# Altium project Finger_PCB.PrjPcb
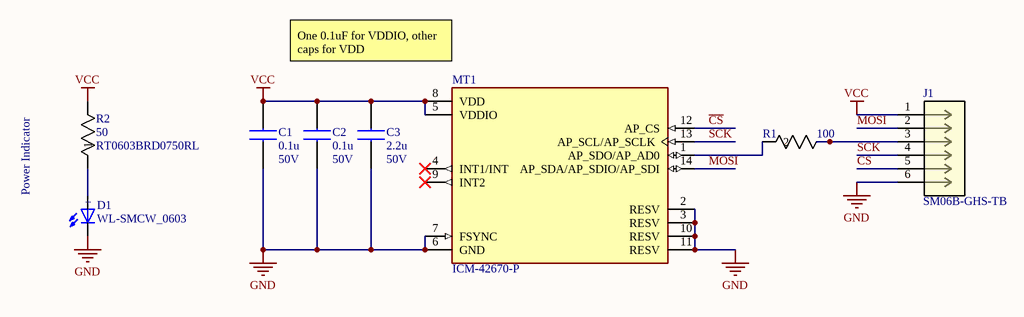
[diagram p0: Finger_IMU_PCB.SchDoc]
SCH_REV: A; PCB_REV: A; PCB_PART_NUMBER: <PCB PN>; PCB_ENGINEER_APP_DATE: --/--/----; PCB_ENGINEER: - -----; PCB_DWG_NO: <PCB DWG NO>; PCB_DESIGNER_APP_DATE: --/--/----; PCB_DESIGNER: - -----; PCB_CHECKER_APP_DATE: --/--/----; PCB_CHECKER: - -----; PCB_ASSEMBLY_NO: <PCB ASSY NO>; PCB_ANG_TOL: +/-1/2; PCB_3_DEC_TOL: +/-.010; PCB_2_DEC_TOL: +/-.01; DOC_NO_SCH_DWG: <SCH DWG NO>; DOC_NO_FAB_DWG: <FAB DWG NO>; DOC_NO_BOM: <BOM DOC NO>; DOC_NO_ASSY_DWG: <ASSY DWG NO>; CONTRACT_NUMBER: <CONTRACT NO>; CAGE_CODE: ?????
1 sheet, 8 parts. Net scope: strictly hierarchical (ports join the sheet entries above them; power ports are local).
Board file: Finger_IMU_PCB.PcbDoc

## Sheet Finger_IMU_PCB.SchDoc
size A; SheetNumber: 1; SheetTotal: 1

### Parts
C1  value 0.1u  Rated Voltage: 50V  [CAPC2012X145N]  (hidden comment: KAM21BR71H104JM)
C2  value 0.1u  Rated Voltage: 50V  [CAPC2012X145N]  (hidden comment: KAM21BR71H104JM)
C3  value 2.2u  Rated Voltage: 50V  [CAPC2012X145N]  (hidden comment: C2012X7R1H225K125AE)
D1  WL-SMCW_0603  [WL-SMCW_0603]
J1  SM06B-GHS-TB  [CONN_SM06B-GHS-TB_JST]
MT1  ICM-42670-P  [XDCR_ICM-42670-P]
R1  value 100  [RC0805N_YAG]  (hidden comment: RC0805JR-07100RL)
R2  RT0603BRD0750RL  value 50  [RES_RT0603_YAG]

### Nets
GND: C1.1 C2.1 C3.1 D1.1(NEG) J1.6 MT1.2(RESV) MT1.3(RESV) MT1.6(GND) MT1.7(FSYNC) MT1.10(RESV) MT1.11(RESV)
VCC: C1.2 C2.2 C3.2 J1.1 MT1.5(VDDIO) MT1.8(VDD) R2.2
~{CS}: J1.5 MT1.12(AP_CS)
MOSI: J1.2 MT1.14(AP_SDA/AP_SDIO/AP_SDI)
SCK: J1.4 MT1.13(AP_SCL/AP_SCLK)
NetD1_2: D1.2(POS) R2.1
NetJ1_3: J1.3 R1.1
NetMT1_1: MT1.1(AP_SDO/AP_AD0) R1.2

Not connected (* = marked no-connect by the designer): MT1 4(INT1/INT)* 9(INT2)*

### Notes on the sheet
- (near MT1) One 0.1uF for VDDIO, other caps for VDD
- Power Indicator
- (in symbol WL-SMCW_0603) +

### Library data of the parts
C1 C2 = KAM21BR71H104JM: Multilayer Ceramic Chip Capacitors, Capacitance=0.1u; Manufacturer_Part_Number: KAM21BR71H104JM
C3 = C2012X7R1H225K125AE: Multilayer Ceramic Chip Capacitors, Capacitance=2.2u; Manufacturer_Part_Number: C2012X7R1H225K125AE
D1 = WL-SMCW_0603: 0603, Yellow Typ.(@20mA): 590nm, 120mcd, 2.0V, 140Â° AlInGaP; MF: Wurth Electronics; MP: 150060YS75000; SnapEDA_Link: https://www.snapeda.com/parts/150060YS75000/Wurth+Electronics/view-part/?ref=snap; Package: 0603 Wurth Electronics; Value: *; Check_prices: https://www.snapeda.com/parts/150060YS75000/Wurth+Electronics/view-part/?ref=eda
J1 = SM06B-GHS-TB: No Description Available; Manufacturer_Name: JST; Copyright: Copyright (C) 2025 Ultra Librarian. All rights reserved.; Manufacturer_Part_Number: SM06B-GHS-TB; RefDes: RefDes; Type: Type
R1 = RC0805JR-07100RL: RES 0805 100 5% 1/8W; Manufacturer_Name: Yageo; Manufacturer_Part_Number: RC0805JR-07100RL; Tolerance: 5%
R2 = RT0603BRD0750RL: No Description Available; Manufacturer_Name: Yageo; Copyright: Copyright (C) 2025 Ultra Librarian. All rights reserved.; Manufacturer_Part_Number: RT0603BRD0750RL
MT1 = ICM-42670-P: Package: None; Price: None; Value: *; MP: ICM-42670-P; Availability: Unavailable